# Altium schematic sheet BIAS.SchDoc
size B; Organization: Altium Limited; Address1: L3, 12a Rodborough Rd; Address2: Frenchs Forest; Address3: NSW; Address4: Australia 2086
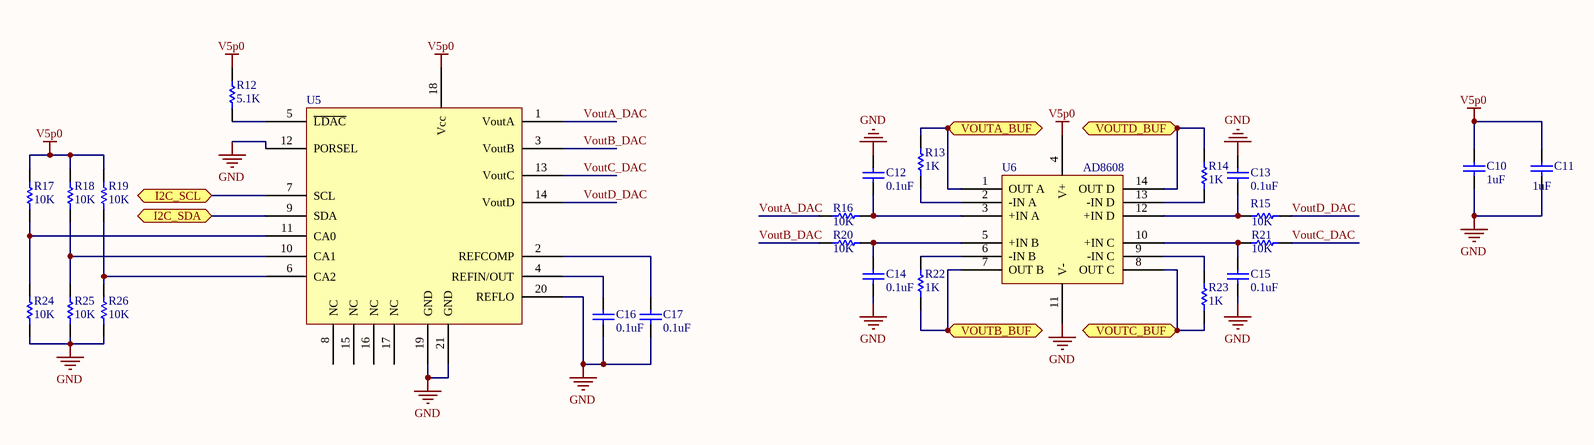
[diagram p0: BIAS.SchDoc]

## Parts
C10  value 1uF  [CAPC01005(0402)22_N]  (hidden comment: CAP, 0402, 1uF)
C11  value 1uF  [CAPC01005(0402)22_N]  (hidden comment: CAP, 0402, 1uF)
C12  value 0.1uF  [CAPC01005(0402)22_N]  (hidden comment: CAP, 0402, 0.1uF)
C13  value 0.1uF  [CAPC01005(0402)22_N]  (hidden comment: CAP, 0402, 0.1uF)
C14  value 0.1uF  [CAPC01005(0402)22_N]  (hidden comment: CAP, 0402, 0.1uF)
C15  value 0.1uF  [CAPC01005(0402)22_N]  (hidden comment: CAP, 0402, 0.1uF)
C16  value 0.1uF  [CAPC01005(0402)22_N]  (hidden comment: CAP, 0402, 0.1uF)
C17  value 0.1uF  [CAPC01005(0402)22_N]  (hidden comment: CAP, 0402, 0.1uF)
R12  5.1K  [RES, 0603]
R13  1K  [RES, 0603]
R14  1K  [RES, 0603]
R15  10K  [RES, 0603]
R16  10K  [RES, 0603]
R17  10K  [RES, 0603]
R18  10K  [RES, 0603]
R19  10K  [RES, 0603]
R20  10K  [RES, 0603]
R21  10K  [RES, 0603]
R22  1K  [RES, 0603]
R23  1K  [RES, 0603]
R24  10K  [RES, 0603]
R25  10K  [RES, 0603]
R26  10K  [RES, 0603]
U5  LTC2655  [QFN50P400X400X70-20N]  (value not drawn)
U6  AD8608  [TSOP65P640X120-14N]

## Ports
I2C_SCL (bidir), I2C_SDA (bidir), VOUTA_BUF (out), VOUTB_BUF (out), VOUTC_BUF (out), VOUTD_BUF (out)

## Nets
GND: C10.1 C11.1 C12.2 C13.1 C14.1 C15.2 C16.1 C17.1 R24.2 R25.2 R26.2 U5.12(PORSEL) U5.19(GND) U5.20(REFLO) U5.21(GND) U6.11(V-)
V5p0: C10.2 C11.2 R12.2 R17.1 R18.1 R19.1 U5.18(Vcc) U6.4(V+)
I2C_SCL: U5.7(SCL) ; port I2C_SCL
I2C_SDA: U5.9(SDA) ; port I2C_SDA
VOUTA_BUF: R13.2 U6.1(OUT_A) ; port VOUTA_BUF
VoutA_DAC: R16.1 U5.1(VoutA)
VOUTB_BUF: R22.1 U6.7(OUT_B) ; port VOUTB_BUF
VoutB_DAC: R20.1 U5.3(VoutB)
VOUTC_BUF: R23.2 U6.8(OUT_C) ; port VOUTC_BUF
VoutC_DAC: R21.1 U5.13(VoutC)
VOUTD_BUF: R14.1 U6.14(OUT_D) ; port VOUTD_BUF
VoutD_DAC: R15.1 U5.14(VoutD)
NetC12_1: C12.1 R16.2 U6.3(+IN_A)
NetC13_2: C13.2 R15.2 U6.12(+IN_D)
NetC14_2: C14.2 R20.2 U6.5(+IN_B)
NetC15_1: C15.1 R21.2 U6.10(+IN_C)
NetC16_2: C16.2 U5.4(REFIN/OUT)
NetC17_2: C17.2 U5.2(REFCOMP)
NetR12_1: R12.1 U5.5(~{LDAC})
NetR13_1: R13.1 U6.2(-IN_A)
NetR14_2: R14.2 U6.13(-IN_D)
NetR17_2: R17.2 R24.1 U5.11(CA0)
NetR18_2: R18.2 R25.1 U5.10(CA1)
NetR19_2: R19.2 R26.1 U5.6(CA2)
NetR22_2: R22.2 U6.6(-IN_B)
NetR23_1: R23.1 U6.9(-IN_C)

Not connected (* = marked no-connect by the designer): U5 8(NC) 15(NC) 16(NC) 17(NC)

## Notes on the sheet
- Title
- Size:
- Date:
- B
- Number:
- Time:
- Revision:
- Sheet
- of
- File:

## Library data of the parts
R12 = RES_0603_5.1K: Resistor, 0603, 1/10W, 5.1K ohm; Manufacturer: Panasonic Electronic Components; Manufacturer Part Number: ERJ-3EKF5101V; Description: RES 5.1K OHM 1/10W 1% 0603 SMD; Tolerance: ±1%; Power (Watts): 0.1W, 1/10W; Temperature Coefficient: ±100ppm/°C; Supplier 1: Digi-Key; RoHS: RoHS Compliant; Category: Resistors; Stock 1: 63967; Pricing 1: 1=0.1, 50=0.0138, 100=0.0105, 250=0.0078, 500=0.00576, 1000=0.00384 (USD); Packaging: Cut Tape (CT); Resistance (Ohms): 5.1k; Composition: Thick Film; Features: -; Package / Case: 0603 (1608 Metric); Supplier Device Package: 0603; Size / Dimension: 0.063" L x 0.031" W (1.60mm x 0.80mm); Height: 0.022" (0.55mm); Number of Terminations: 2; ComponentLink1URL: http://industrial.panasonic.com/www-cgi/jvcr13pz.cgi?E+PZ+3+AOA0002+ERJ3EKF5101V+7+WW; ComponentLink1Description: http://industrial.panasonic.com/www-cgi/jvcr13pz.cgi?E+PZ+3+AOA0002+ERJ3EKF5101V+7+WW; Supplier Part Number 1: P5.10KHCT-ND
R13 R14 R22 R23 = RES_0603_1K: Resistor, 0603, 1/10W, 1K ohm; Manufacturer: Panasonic Electronic Components; Manufacturer Part Number: ERJ-3EKF1001V; Description: RES 1K OHM 1/10W 1% 0603 SMD; Tolerance: ±1%; Power (Watts): 0.1W, 1/10W; Temperature Coefficient: ±100ppm/°C; Supplier 1: Digi-Key; RoHS: RoHS Compliant; Category: Resistors; Stock 1: 3447685; Pricing 1: 1=0.1, 50=0.0138, 100=0.0105, 250=0.0078, 500=0.00576, 1000=0.00384 (USD); Packaging: Cut Tape (CT); Resistance (Ohms): 1k; Composition: Thick Film; Features: -; Package / Case: 0603 (1608 Metric); Supplier Device Package: 0603; Size / Dimension: 0.063" L x 0.031" W (1.60mm x 0.80mm); Height: 0.022" (0.55mm); Number of Terminations: 2; ComponentLink1URL: http://industrial.panasonic.com/www-cgi/jvcr13pz.cgi?E+PZ+3+AOA0002+ERJ3EKF1001V+7+WW; ComponentLink1Description: http://industrial.panasonic.com/www-cgi/jvcr13pz.cgi?E+PZ+3+AOA0002+ERJ3EKF1001V+7+WW; Supplier Part Number 1: P1.00KHCT-ND
R15-R21 R24-R26 = RES_0603_10K: Resistor, 0603, 1/10W, 10K ohm; Manufacturer: Panasonic Electronic Components; Manufacturer Part Number: ERJ-3EKF1002V; Description: RES 10K OHM 1/10W 1% 0603 SMD; Tolerance: ±1%; Power (Watts): 0.1W, 1/10W; Temperature Coefficient: ±100ppm/°C; Supplier 1: Digi-Key; RoHS: RoHS Compliant; Category: Resistors; Stock 1: 4631019; Pricing 1: 1=0.1, 50=0.0138, 100=0.0105, 250=0.0078, 500=0.00576, 1000=0.00384 (USD); Packaging: Cut Tape (CT); Resistance (Ohms): 10k; Composition: Thick Film; Features: -; Package / Case: 0603 (1608 Metric); Supplier Device Package: 0603; Size / Dimension: 0.063" L x 0.031" W (1.60mm x 0.80mm); Height: 0.022" (0.55mm); Number of Terminations: 2; ComponentLink1URL: http://industrial.panasonic.com/www-cgi/jvcr13pz.cgi?E+PZ+3+AOA0002+ERJ3EKF1002V+7+WW; ComponentLink1Description: http://industrial.panasonic.com/www-cgi/jvcr13pz.cgi?E+PZ+3+AOA0002+ERJ3EKF1002V+7+WW; Supplier Part Number 1: P10.0KHCT-ND
U5 = LTC2655: Quad I2C 16-/12-Bit Rail-to-Rail DACs with 10ppm/°C Max Reference; Supplier 1: Digi-Key; Supplier Part Number 1: LTC2655BIUF-L16#PBF-ND
U6 = AD8608; Quad Op-Amp: Manufacturer: Analog Devices Inc; Manufacturer Part Number: AD8608ARZ-REEL; Amplifier Type: General Purpose; Number of Circuits: 4; Output Type: Rail-to-Rail; Slew Rate: 5 V/µs; Gain Bandwidth Product: 10MHz; Current - Input Bias: 0.2pA; Voltage - Input Offset: 80µV; Current - Supply: 1mA; Current - Output / Channel: 80mA; Voltage - Supply, Single/Dual (±): 2.7 V ~ 5.5 V; Description: IC OPAMP GP 10MHZ RRO 14SOIC; Packaging: Cut Tape (CT); -3db Bandwidth: -; Operating Temperature: -40°C ~ 125°C; Mounting Type: Surface Mount; Package / Case: 14-SOIC (0.154", 3.90mm Width); Supplier Device Package: 14-SOIC; ComponentLink1URL: http://www.analog.com/static/imported-files/data_sheets/AD8605_8606_8608.pdf; ComponentLink1Description: http://www.analog.com/static/imported-files/data_sheets/AD8605_8606_8608.pdf; Supplier 1: Digi-Key; Supplier Part Number 1: AD8608ARZ-REELCT-ND; RoHS: RoHS Compliant; Stock 1: 2419; Pricing 1: 1=4.22, 10=3.785, 25=3.4036, 100=3.0954, 250=2.80196, 500=2.50858, 1000=2.11248 (USD); Category: Integrated Circuits (ICs)
C10 C11 = CAP, 0402, 1uF: Supplier 1: Digi-Key; Supplier Part Number 1: 587-3245-1-ND
C12-C17 = CAP, 0402, 0.1uF: Supplier 1: Digi-Key; Supplier Part Number 1: 587-1456-2-ND